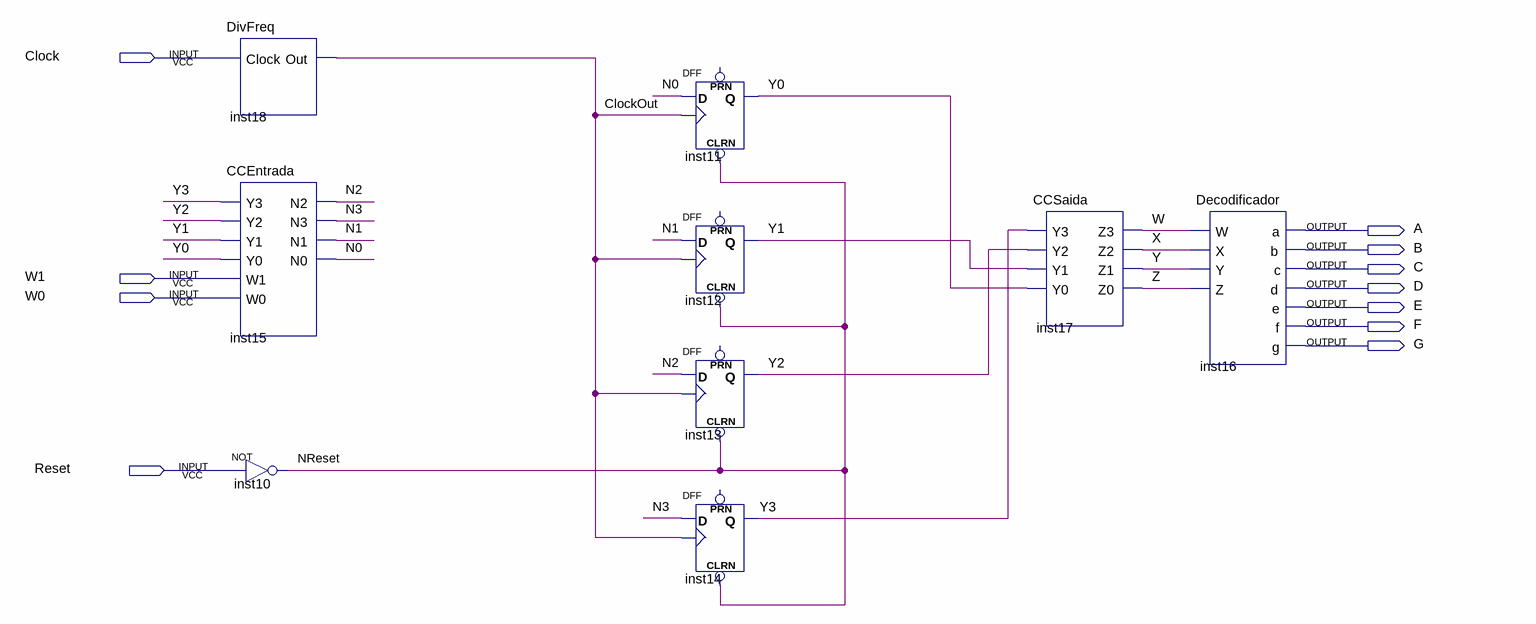
[diagram p0: schematic sheet]
// Quartus schematic MaquinaMoore.bdf as structural Verilog: 9 symbols, 11 pins
module MaquinaMoore (
  input  Clock,
  input  W1,
  input  W0,
  input  Reset,
  output A,
  output B,
  output C,
  output D,
  output E,
  output F,
  output G
);

  wire ClockOut, N0, N1, N2, N3, NReset, W, X, Y, Y0, Y1, Y2, Y3, Z;

  DivFreq inst18 (.Clock(Clock), .Out(ClockOut));
  CCEntrada inst15 (.Y3(Y3), .Y2(Y2), .Y1(Y1), .Y0(Y0), .W1(W1), .W0(W0), .N2(N2), .N3(N3), .N1(N1), .N0(N0));
  not inst10 (NReset, Reset);
  DFF inst11 (.CLRN(NReset), .CLK(ClockOut), .D(N0), .Q(Y0));  // open: PRN
  DFF inst12 (.CLRN(NReset), .CLK(ClockOut), .D(N1), .Q(Y1));  // open: PRN
  DFF inst13 (.CLRN(NReset), .CLK(ClockOut), .D(N2), .Q(Y2));  // open: PRN
  DFF inst14 (.CLRN(NReset), .CLK(ClockOut), .D(N3), .Q(Y3));  // open: PRN
  CCSaida inst17 (.Y3(Y3), .Y2(Y2), .Y1(Y1), .Y0(Y0), .Z3(W), .Z2(X), .Z1(Y), .Z0(Z));
  Decodificador inst16 (.W(W), .X(X), .Y(Y), .Z(Z), .a(A), .b(B), .c(C), .d(D), .e(E), .f(F), .g(G));
endmodule
